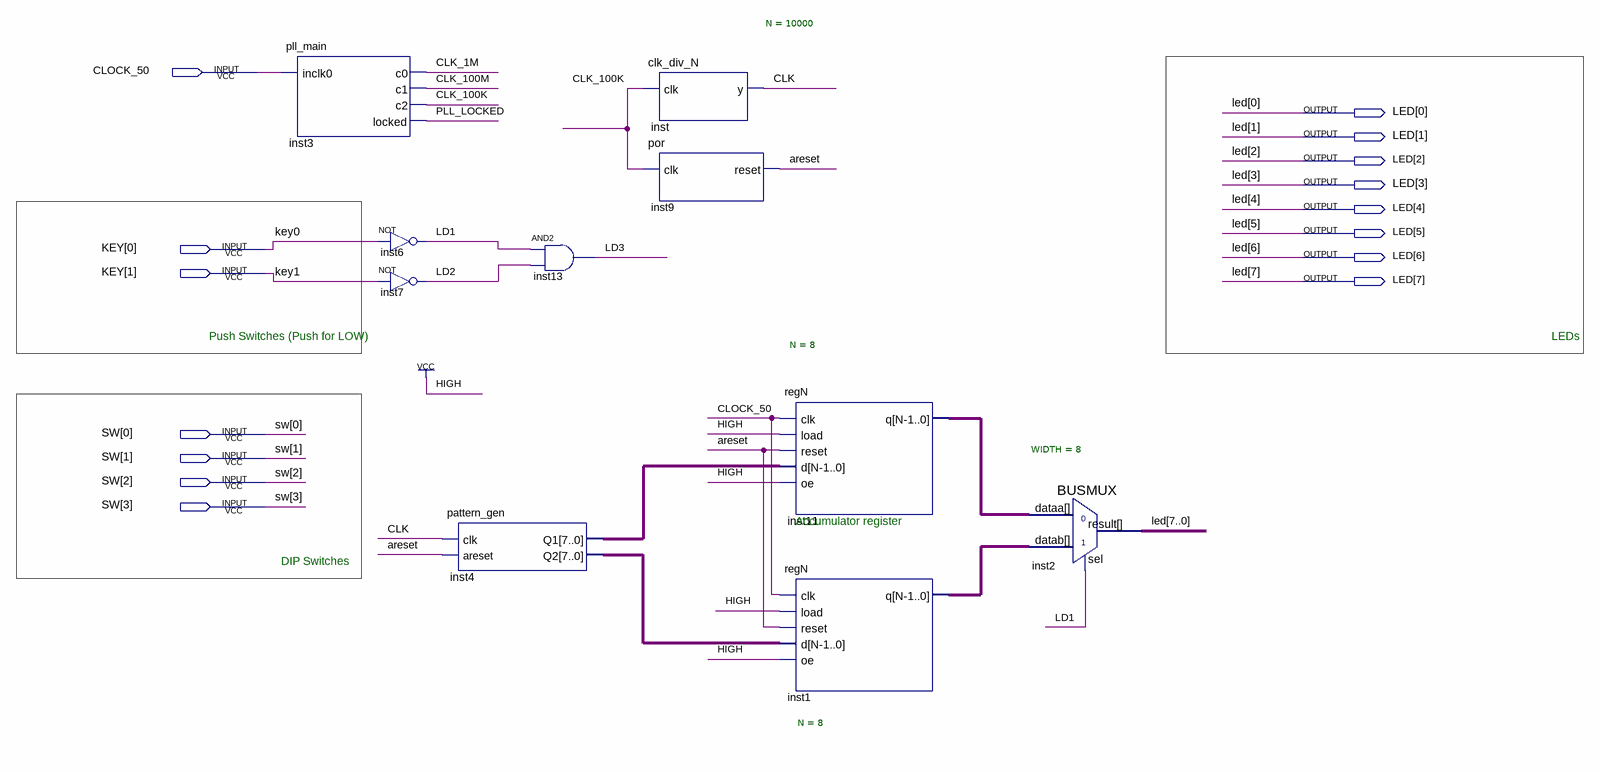
[diagram p0: schematic sheet]
// Quartus schematic TopLevelSchematic.bdf as structural Verilog: 10 symbols, 15 pins
module TopLevelSchematic (
  input  CLOCK_50,
  input  [1:0] KEY,
  input  [3:0] SW,
  output [7:0] LED
);

  wire areset, CLK, CLK_1M, CLK_100K, CLK_100M, LD1, LD2, LD3, PLL_LOCKED;
  wire [7:0] inst1_q, inst4_q1, inst4_q2, inst11_q;

  pll_main inst3 (.inclk0(CLOCK_50), .c0(CLK_1M), .c1(CLK_100M), .c2(CLK_100K), .locked(PLL_LOCKED));
  not inst6 (LD1, KEY[0]);
  not inst7 (LD2, KEY[1]);
  pattern_gen inst4 (.clk(CLK), .areset(areset), .Q1(inst4_q1), .Q2(inst4_q2));
  and inst13 (LD3, LD1, LD2);
  clk_div_N #(.N(10000)) inst (.clk(CLK_100K), .y(CLK));
  por inst9 (.clk(CLK_100K), .reset(areset));
  regN #(.N(8)) inst11 (.clk(CLOCK_50), .load(1'b1), .reset(areset), .d(inst4_q1), .oe(1'b1), .q(inst11_q));
  regN #(.N(8)) inst1 (.clk(CLOCK_50), .load(1'b1), .reset(areset), .d(inst4_q2), .oe(1'b1), .q(inst1_q));
  BUSMUX #(.WIDTH(8)) inst2 (.datab(inst1_q), .sel(LD1), .dataa(inst11_q), .result(LED));

  // Notes on the sheet:
  //   Push Switches (Push for LOW)
  //   LEDs
  //   Accumulator register
  //   DIP Switches
endmodule
